# EasyEDA Pro project ProDoc_board_2025-08-24.epro

# Schematic board

## Sheets
1 board_1
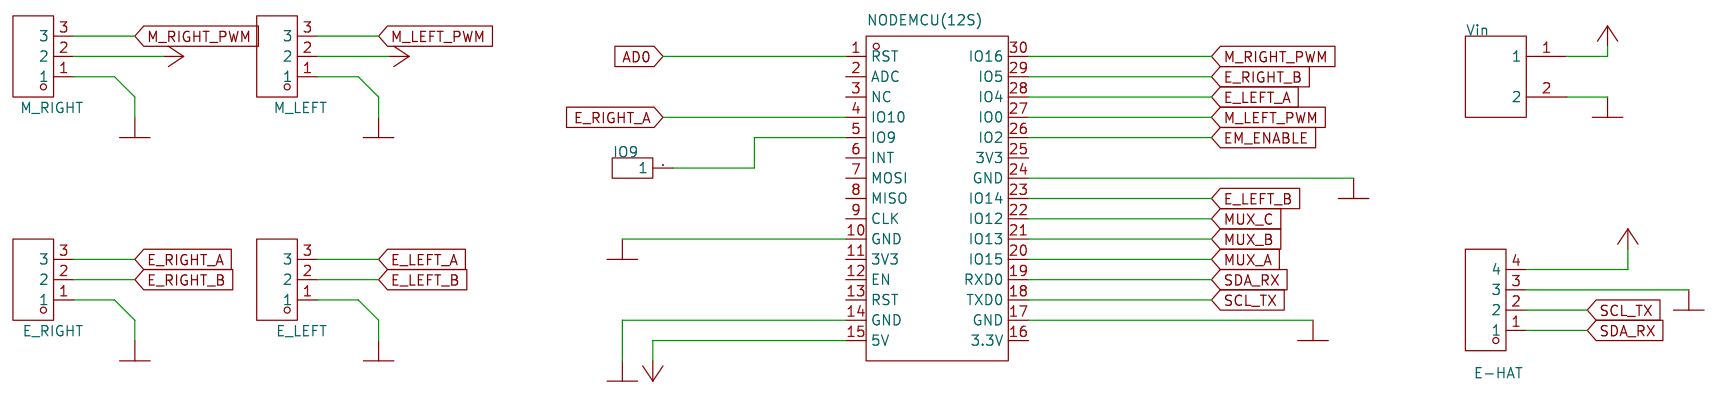
[diagram p0: board_1]
2 board_2
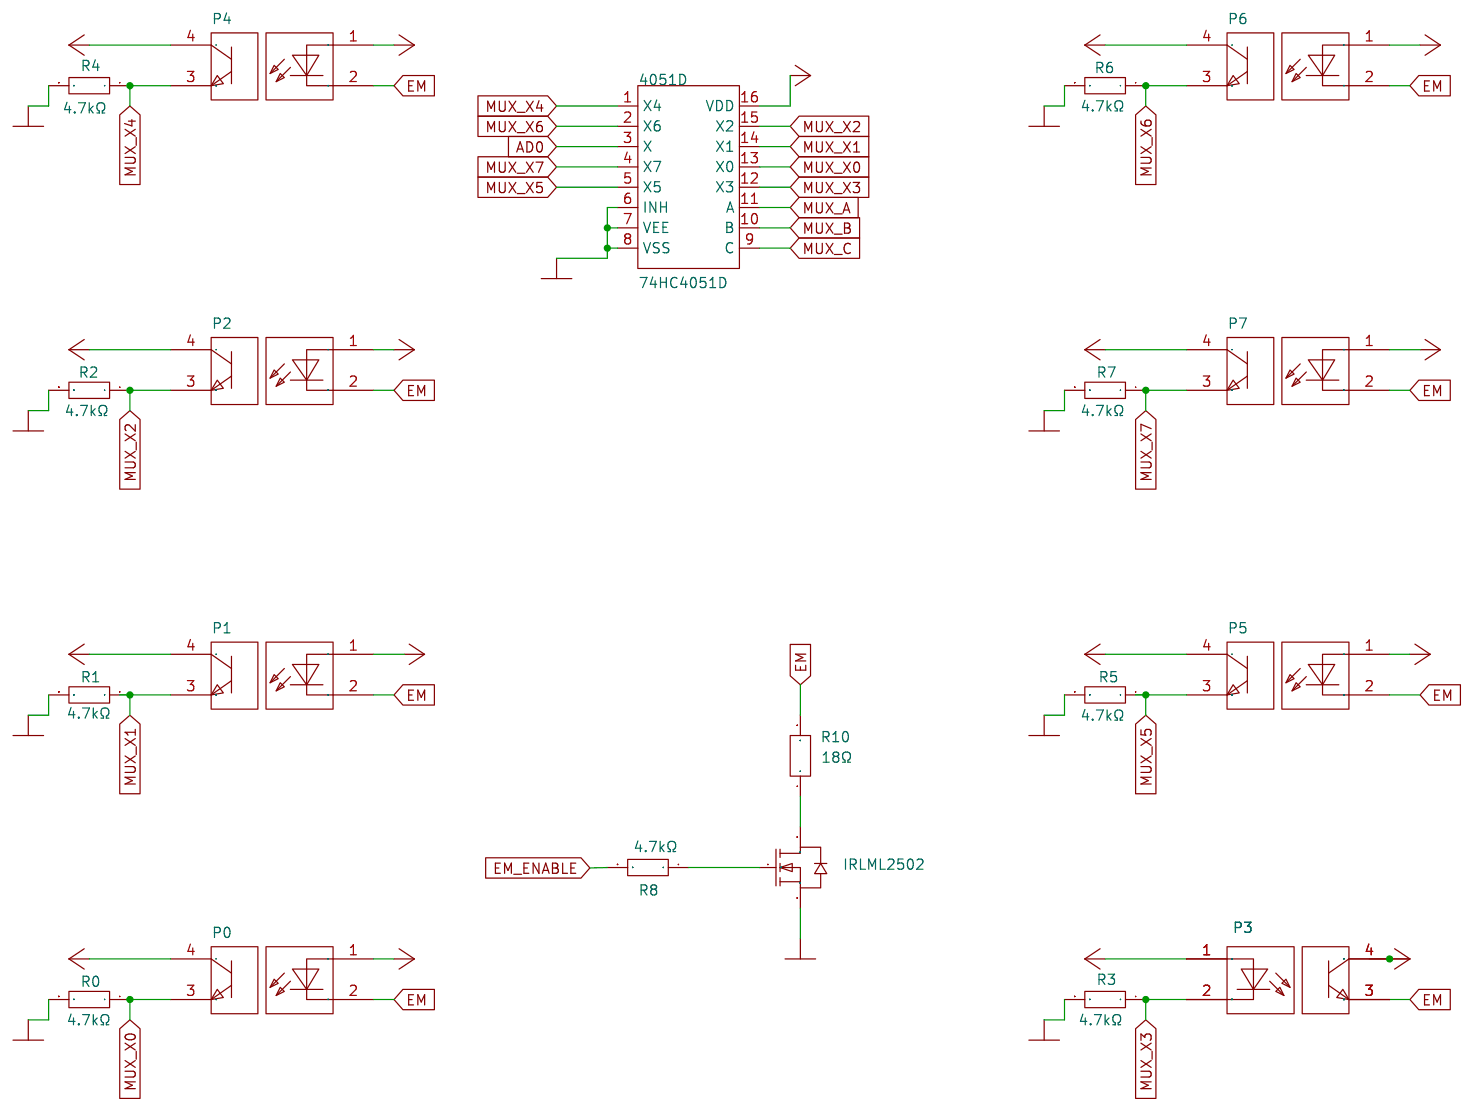
[diagram p1: board_2]
3 board_3
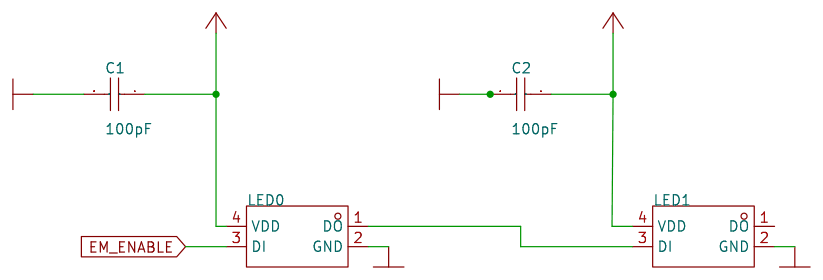
[diagram p2: board_3]

## Parts
sheet board_1
E-HAT  2.54-1*4P母  [HDR-TH_4P-P2.54-V-F]
E_LEFT  ZX-XH2.54-3PZZ  [CONN-TH_3P-P2.54_2501S-3P]
E_RIGHT  ZX-XH2.54-3PZZ  [CONN-TH_3P-P2.54_2501S-3P]
ESP-12E  NODEMCU(12S)  [COMM-TH_L43.7-W25.4-P2.54_NODEMCU]
IO9  Header-Male-2.54_1x1  [HDR-1X1/2.54]
M_LEFT  ZX-XH2.54-3PZZ  [CONN-TH_3P-P2.54_2501S-3P]
M_RIGHT  ZX-XH2.54-3PZZ  [CONN-TH_3P-P2.54_2501S-3P]
Vin  B2B-PH-K-S(LF)(SN)  [CONN-TH_B2B-PH-K-S]
sheet board_2
4051D  74HC4051D  [SOIC-16_L9.9-W3.9-P1.27-LS6.0-BL]
IRLML2502  IRLML2502TRPBF  [SOT-23_L2.9-W1.3-P1.90-LS2.4-BR]
P0  TCRT5000  [OPTO-TH_TCRT5000]
P1  TCRT5000  [OPTO-TH_TCRT5000]
P2  TCRT5000  [OPTO-TH_TCRT5000]
P3  TCRT5000  [OPTO-TH_TCRT5000]
P4  TCRT5000  [OPTO-TH_TCRT5000]
P5  TCRT5000  [OPTO-TH_TCRT5000]
P6  TCRT5000  [OPTO-TH_TCRT5000]
P7  TCRT5000  [OPTO-TH_TCRT5000]
R0  4.7kΩ  [R0603]
R1  4.7kΩ  [R0603]
R2  4.7kΩ  [R0603]
R3  4.7kΩ  [R0603]
R4  4.7kΩ  [R0603]
R5  4.7kΩ  [R0603]
R6  4.7kΩ  [R0603]
R7  4.7kΩ  [R0603]
R8  4.7kΩ  [R0603]
R10  18Ω  [R0402]
sheet board_3
C1  100pF  [C0402]
C2  100pF  [C0402]
LED0  WS2812B-2020  [LED-SMD_4P-L2.0-W2.0-TL_WS2812B-2020]
LED1  WS2812B-2020  [LED-SMD_4P-L2.0-W2.0-TL_WS2812B-2020]

## Library data of the parts
E-HAT = 2.54-1*4P母: Holes Structure:1x4P Pitch:2.54mm Row Spacing:- Circular Hole / Square Hole:Square Holes Mounting Type:Straight Number of Rows:Plugin Number of Holes:4P Current Rating (Max):3A Voltage Rating (Max):- Holes Direction:Top Insulation Height:- Contact Materia; LCSC Part Name: 间距:2.54mm 1x4P 直插; Supplier Part: C2718488; Manufacturer: BOOMELE(博穆精密); Supplier Footprint: 插件,P=2.54mm; JLCPCB Part Class: Extended Part; Datasheet: https://atta.szlcsc.com/upload/public/pdf/source/20210301/C2718488_F4427B881E42CAA8DDB0B1C12B3A522C.pdf; Supplier: LCSC; Holes Structure: 1x4P; Pitch: 2.54mm; Circular Hole / Square Hole: Square Holes; Mounting Type: Straight; Number of Rows: Plugin; Number of Holes: 4P; Current Rating (Max): 3A; Holes Direction: Top; Contact Material: bronze; Operating Temperature Range: -40℃~+105℃
E_LEFT E_RIGHT M_LEFT M_RIGHT = ZX-XH2.54-3PZZ: Pins Structure:1x3P Pitch:2.5mm Mounting Type:Direct Insert Reference Series:XH Number of Pins:3P Number of Rows:1 Number of PINs Per Row:3 Row Spacing:- Rated Current:3A Contact Material:Brass Contact Plating:Tin Operating Temperature:-25℃~+85℃ Operating; LCSC Part Name: 1x3P 间距:2.5mm 直插 系列:XH; Supplier Part: C7429633; Manufacturer: Megastar(兆星); Supplier Footprint: 插件,P=2.5mm; JLCPCB Part Class: Extended Part; Datasheet: https://atta.szlcsc.com/upload/public/pdf/source/20230619/AE17037A2CFDBE8D9CBA775D61AD0A84.pdf; Supplier: LCSC; Pins Structure: 1x3P; Pitch: 2.5mm; Mounting Type: Direct Insert; Reference Series: XH; Number of Pins: 3P; Number of Rows: 1; Number of PINs Per Row: 3; Rated Current: 3A; Contact Material: Brass; Contact Plating: Tin; Operating Temperature: -25℃~+85℃; Rated Voltage (Max): 250V; Plastic Material: PA66; Flame Retardant Rating: UL94V-0; Color: White; Z-Height of the Board: 7mm; X-Length of Bottom Edge on Board (Spacing Line): 10mm; Y-Width of Bottom Edge on Board: 5.9mm
ESP-12E = NODEMCU(12S): CPU:- ROM Size:- Number of I/O: USB:- WIFI Protocols:- Bluetooth:- Ethernet:- Audio & Video Interface:- Multimedia Support:- Card Type:- Power Supply Type:- Power Supply:- POE Support:- Resolution:- Temperature Range:-; LCSC Part Name: wifi测试板 NODEMCU(12S); Supplier Part: C2764073; Manufacturer: Ai-Thinker(安信可); JLCPCB Part Class: Extended Part; Datasheet: https://atta.szlcsc.com/upload/public/pdf/source/20210401/C2764073_24755F314752A2828420B4B3FC3498D8.pdf; Supplier: LCSC
IO9 = Header-Male-2.54_1x1: Supplier Part: C81276; Supplier: LCSC; Manufacturer: ReliaPro; spicePre: P
Vin = B2B-PH-K-S(LF)(SN): Pins Structure:1x2P Pitch:2mm Mounting Type:Direct Insert Reference Series:PH Number of Pins:2P Number of Rows:1 Number of PINs Per Row:2 Row Spacing:- Current Rating:2A Contact Material:Brass Contact Plating:Tin Operating Temperature:-25℃~+85℃ Operating; LCSC Part Name: 1x2P 间距:2mm 直插 系列:PH; Supplier Part: C131337; Manufacturer: JST; Supplier Footprint: 插件,P=2mm; JLCPCB Part Class: Extended Part; Datasheet: https://atta.szlcsc.com/upload/public/pdf/source/20171026/C131342_15089839687311058815.pdf; Supplier: LCSC; Pins Structure: 1x2P; Pitch: 2mm; Mounting Type: Direct Insert; Reference Series: PH; Number of Pins: 2P; Number of Rows: 1; Number of PINs Per Row: 2; Current Rating: 2A; Contact Material: Brass; Contact Plating: Tin; Operating Temperature: -25℃~+85℃; Voltage Rating: 100V; Plastic Material: PA66; Flame Retardant Rating: UL94V-0; Supplementary Features: K-leg punch; Color: White; Z-Height of the Board: 6mm; X-Length of Bottom Edge on Board (Spacing Line): 5.9mm; Y-Width of Bottom Edge on Board: 4.5mm
4051D = 74HC4051D: Switch Circuit:- Number of Channels:1 Supply Voltage:2V~6V Supply Voltage:2V~6V Turn-on time:34ns On-State Resistance (Max):130Ω; Supplier Part: C2673644; Manufacturer: TOSHIBA(东芝); Supplier Footprint: SOIC-16; JLCPCB Part Class: Extended Part; Datasheet: https://atta.szlcsc.com/upload/public/pdf/source/20211008/C2673644_73EA3E8FAA5905ED58292DB2FEFACB5C.pdf; Supplier: LCSC; Number of Channels: 1; Supply Voltage: 2V~6V; Turn-on time: 34ns; On-State Resistance (Max): 130Ω
IRLML2502 = IRLML2502TRPBF_C5123960: Drain to Source Voltage:20V Current - Continuous Drain(Id):- RDS(on):35mΩ@4.5V,6A Pd - Power Dissipation:1.25W Gate Threshold Voltage (Vgs(th)@Id):1V Gate Charge(Qg):7.7nC@4.5V Input Capacitance(Ciss@Vds):574pF@10V Reverse Transfer Capacitance (Crss@Vds):; LCSC Part Name: 耐压:20V 电流:6A; Supplier Part: C5123960; Manufacturer: TECH PUBLIC(台舟); Supplier Footprint: SOT-23; JLCPCB Part Class: Extended Part; Datasheet: https://atta.szlcsc.com/upload/public/pdf/source/20221011/B82AF47BD8A04DF3592B94FC71962113.pdf; Supplier: LCSC; Drain to Source Voltage: 20V; RDS(on): 35mΩ@4.5V,6A; Pd - Power Dissipation: 1.25W; Gate Threshold Voltage (Vgs(th)@Id): 1V; Gate Charge(Qg): 7.7nC@4.5V; Input Capacitance(Ciss@Vds): 574pF@10V; Operating Temperature: -55℃~+150℃
P0-P7 = TCRT5000: Sensing Distance:15mm Collector Current (Max):100mA; Supplier Part: C2984661; Manufacturer: VISHAY(威世); Supplier Footprint: DIP-4; JLCPCB Part Class: Extended Part; Datasheet: https://atta.szlcsc.com/upload/public/pdf/source/20220524/56309200CFD992CFE90087BA59F1182D.pdf; Supplier: LCSC; Sensing Distance: 15mm; Collector Current (Max): 100mA
R0-R8 = RC0603FR-074K7L: Type:Thick Film Resistors Resistance: Tolerance:±1% Tolerance:±1% Power(Watts): Overload Voltage (Max): Temperature Coefficient:±100ppm/℃ Temperature Coefficient:±100ppm/℃ Operating Temperature Range:-55℃~+155℃ Operating Temperature Range:-55℃~+155℃; LCSC Part Name: 厚膜电阻 4.7kΩ ±1% 100mW; Supplier Part: C99782; Manufacturer: YAGEO(国巨); Supplier Footprint: 0603; JLCPCB Part Class: Extended Part; Datasheet: https://atta.szlcsc.com/upload/public/pdf/source/20180224/C181757_15194369480721363983.pdf; Supplier: LCSC; Type: Thick Film Resistors; Tolerance: ±1%; Temperature Coefficient: ±100ppm/℃; Operating Temperature Range: -55℃~+155℃
R10 = FRC0402F18R0TS: Type:Thick Film Resistors Resistance: Tolerance:±1% Tolerance:±1% Power(Watts): Overload Voltage (Max): Temperature Coefficient:±100ppm/℃ Temperature Coefficient:±100ppm/℃ Operating Temperature Range:-55℃~+155℃ Operating Temperature Range:-55℃~+155℃; LCSC Part Name: 18Ω ±1% 62.5mW 厚膜电阻; Supplier Part: C2929991; Manufacturer: FOJAN(富捷); Supplier Footprint: 0402; JLCPCB Part Class: Extended Part; Datasheet: https://atta.szlcsc.com/upload/public/pdf/source/20211221/925EC7D7225764EE0046F22065062C87.pdf; Supplier: LCSC; Type: Thick Film Resistors; Tolerance: ±1%; Temperature Coefficient: ±100ppm/℃; Operating Temperature Range: -55℃~+155℃
C1 C2 = GRM1555C1H101JA01D: Capacitance: Tolerance:±5% Tolerance:±5% Voltage Rated: Temperature Coefficient:; LCSC Part Name: 100pF ±5% 50V; Supplier Part: C77177; Manufacturer: muRata(村田); Supplier Footprint: 0402; JLCPCB Part Class: Extended Part; Datasheet: https://atta.szlcsc.com/upload/public/pdf/source/20161108/1478586482814.pdf; Supplier: LCSC; Tolerance: ±5%; Check: false
LED0 LED1 = WS2812B-2020: Wavelength:515.6nm；622.5nm；470.4nm Luminous Intensity:- Fixed-Frequency Pwm Mode:- Data Transmission Rate:- Supply Voltage:- Supply Voltage:- Quiescent Dissipation:- Lens Color:-; LCSC Part Name: RGB三色; Supplier Part: C965555; Manufacturer: worldsemi; Supplier Footprint: SMD,2x2mm; JLCPCB Part Class: Extended Part; Datasheet: https://atta.szlcsc.com/upload/public/pdf/source/20241202/DEE3FC25B8AD87F3BB1718ACD77EDECD.pdf; Supplier: LCSC; Wavelength: 515.6nm；622.5nm；470.4nm; Check: false

## Nets
GND: 4051D.6(INH) 4051D.7(VEE) 4051D.8(VSS) C1.2 C2.2 E-HAT.3 E_LEFT.1 E_RIGHT.1 ESP-12E.10(GND) ESP-12E.14(GND) ESP-12E.17(GND) ESP-12E.24(GND) IRLML2502.2(S) LED0.2(GND) LED1.2(GND) M_LEFT.1 M_RIGHT.1 R0.2 R1.2 R2.2 R3.2 R4.2 R5.2 R6.2 R7.2 Vin.2
VCC: 4051D.16(VDD) C1.1 C2.1 E-HAT.4 ESP-12E.15(5V) LED0.4(VDD) LED1.4(VDD) M_LEFT.2 M_RIGHT.2 P0.1 P0.4 P1.1 P1.4 P2.1 P2.4 P3.1 P3.4 P4.1 P4.4 P5.1 P5.4 P6.1 P6.4 P7.1 P7.4 Vin.1
AD0: 4051D.3(X) ESP-12E.1(RST)
E_LEFT_A: E_LEFT.3 ESP-12E.28(IO4)
E_LEFT_B: E_LEFT.2 ESP-12E.23(IO14)
E_RIGHT_A: E_RIGHT.3 ESP-12E.4(IO10)
E_RIGHT_B: E_RIGHT.2 ESP-12E.29(IO5)
EM: P0.2 P1.2 P2.2 P3.3 P4.2 P5.2 P6.2 P7.2 R10.2
EM_ENABLE: ESP-12E.26(IO2) LED0.3(DI)
M_LEFT_PWM: ESP-12E.27(IO0) M_LEFT.3
M_RIGHT_PWM: ESP-12E.30(IO16) M_RIGHT.3
MUX_A: 4051D.11(A) ESP-12E.20(IO15)
MUX_B: 4051D.10(B) ESP-12E.21(IO13)
MUX_C: 4051D.9(C) ESP-12E.22(IO12)
MUX_X0: 4051D.13(X0) P0.3 R0.1
MUX_X1: 4051D.14(X1) P1.3 R1.1
MUX_X2: 4051D.15(X2) P2.3 R2.1
MUX_X3: 4051D.12(X3) P3.2 R3.1
MUX_X4: 4051D.1(X4) P4.3 R4.1
MUX_X5: 4051D.5(X5) P5.3 R5.1
MUX_X6: 4051D.2(X6) P6.3 R6.1
MUX_X7: 4051D.4(X7) P7.3 R7.1
SCL_TX: E-HAT.2 ESP-12E.18(TXD0)
SDA_RX: E-HAT.1 ESP-12E.19(RXD0)
$1N3482: ESP-12E.5(IO9) IO9.1
$2N5544: IRLML2502.3(D) R10.1
Net-(LED0-1): LED0.1(DO) LED1.3(DI)

Not connected (* = marked no-connect by the designer): ESP-12E 2(ADC) 3(NC) 6(INT) 7(MOSI) 8(MISO) 9(CLK) 11(3V3) 12(EN) 13(RST) 16(3.3V) 25(3V3); IRLML2502 1(G); LED1 1(DO); R8 1 2

# Board board
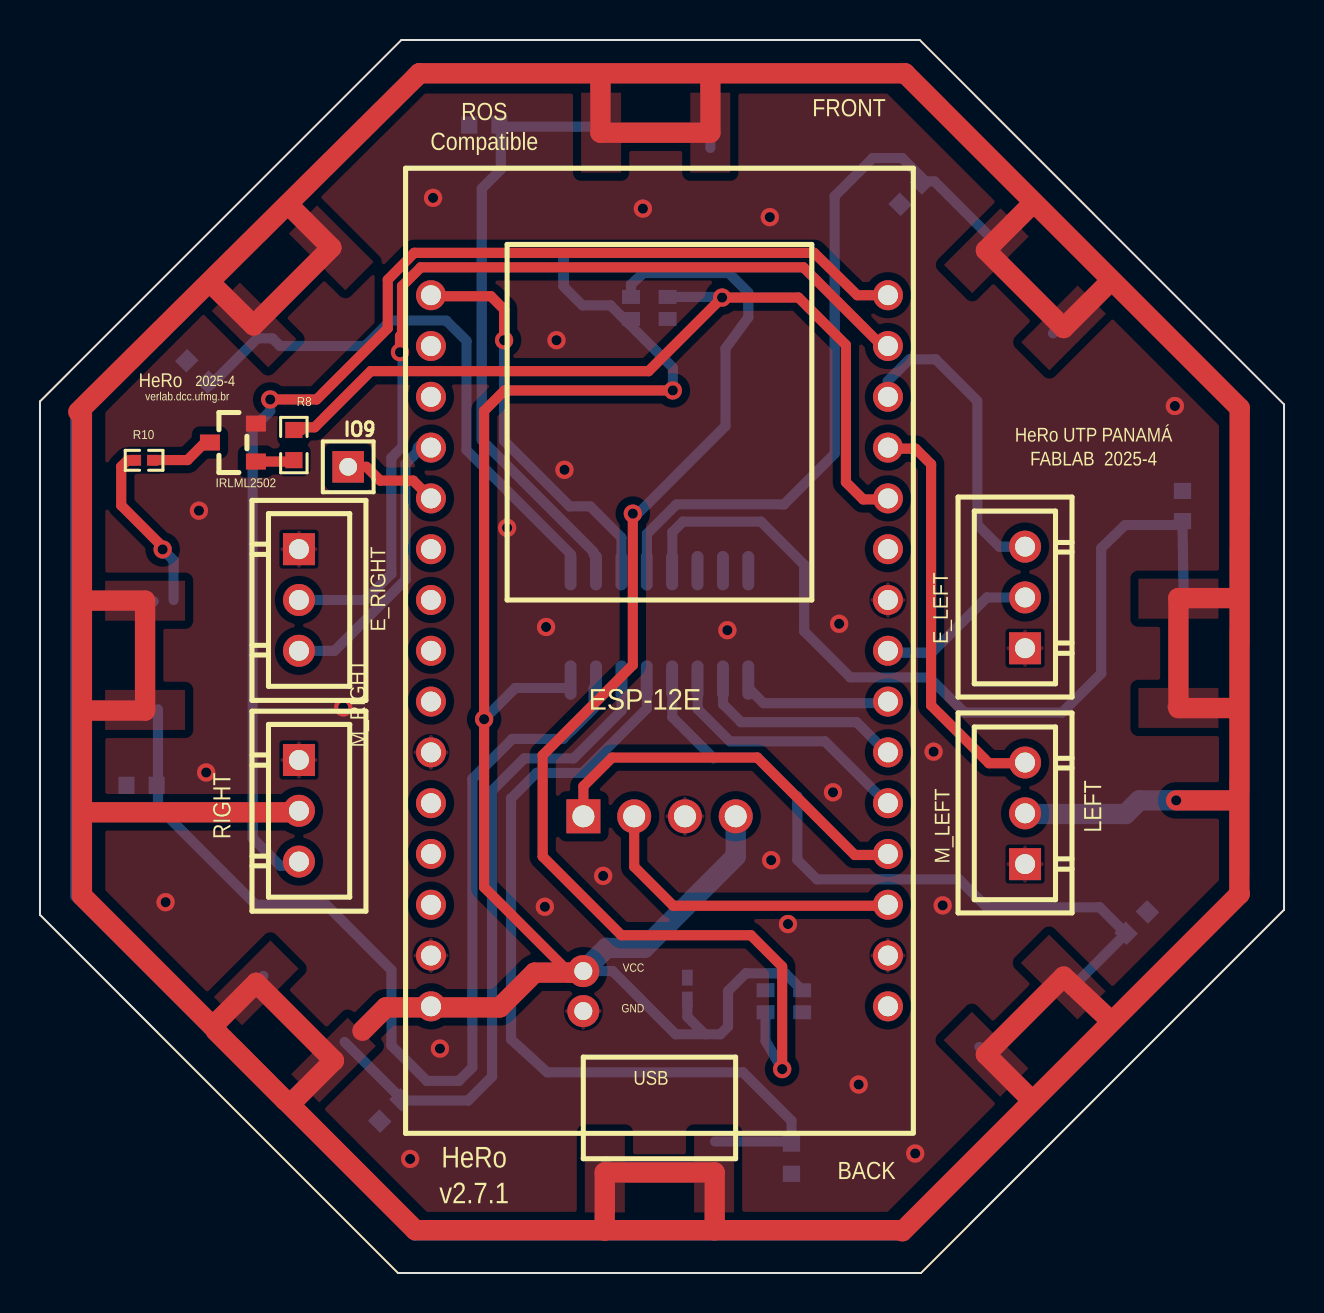
[diagram p3: board, top side]
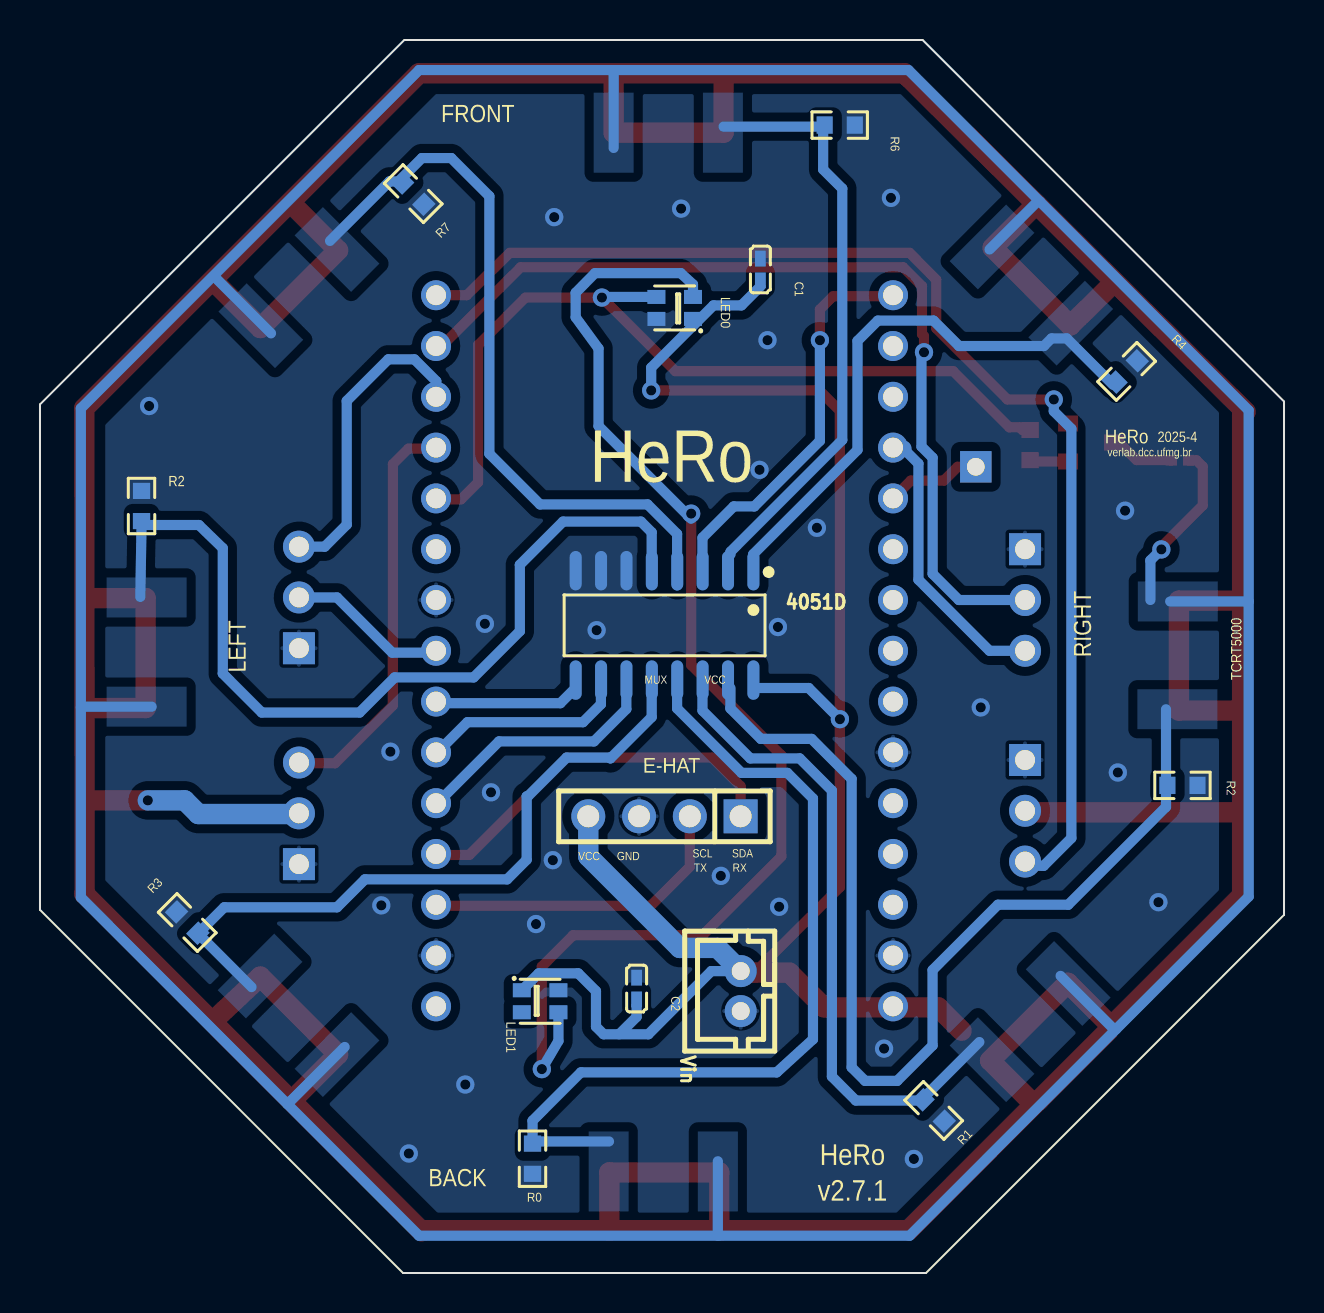
[diagram p4: board, bottom side, seen from below]

Outline 62.23 x 61.66 mm; copper layers: Top Layer, Bottom Layer. Coordinates in mm from the lower left corner of the outline.
Outline path: 0,43.58 0,17.91 17.91,0 44.07,0 62.23,18.16 62.23,43.43 44.01,61.66 18.08,61.66 0,43.58
Stack: Top Layer 0.035mm / Dielectric1 1.51mm FR4 er 4.5 / Bottom Layer 0.035mm

## Design rules (mm)
spacing safeClearance (default): track to track 0.203, other pairs 0.203 to 1.016
spacing gnd: track to track 0.203, other pairs 0.203 to 1.016
track width trackWidth (default): min 0.508, default 0.508, max 2.54
track width gnd: min 0.508, default 0.508, max 2.54
differential pair differentialPair (default): width min 0.127, default 0.254, max 2.54; gap min 0.152, default 0.152
via viaSize (default): diameter min 0.508, default 0.508, max 2.6; hole min 0.508, default 0.508, max 2
via gnd: diameter min 0.508, default 0.508, max 2.6; hole min 0.508, default 0.508, max 2
net GND uses CopperRegion1
pour ie1 uses CopperRegion
pour ie2 uses CopperRegion1

## Placement (name value [footprint] x y rotation side)
4051D  74HC4051D  [SOIC-16_L9.9-W3.9-P1.27-LS6.0-BL]  30.99 32.39 0 bottom
C1  100pF  [C0402]  26.19 50.18 90 bottom
C2  100pF  [C0402]  32.39 14.22 90 bottom
E-HAT  2.54-1*4P母  [HDR-TH_4P-P2.54-V-F]  30.99 22.84 0 bottom
E_LEFT  ZX-XH2.54-3PZZ  [CONN-TH_3P-P2.54_2501S-3P]  49.28 33.78 90 top
E_RIGHT  ZX-XH2.54-3PZZ  [CONN-TH_3P-P2.54_2501S-3P]  12.95 33.66 270 top
ESP-12E  NODEMCU(12S)  [COMM-TH_L43.7-W25.4-P2.54_NODEMCU]  30.99 31.11 0 top
IO9  Header-Male-2.54_1x1  [HDR-1X1/2.54]  15.42 40.31 0 top
IRLML2502  IRLML2502TRPBF  [SOT-23_L2.9-W1.3-P1.90-LS2.4-BR]  9.65 41.53 0 top
LED0  WS2812B-2020  [LED-SMD_4P-L2.0-W2.0-TL_WS2812B-2020]  30.48 48.26 0 bottom
LED1  WS2812B-2020  [LED-SMD_4P-L2.0-W2.0-TL_WS2812B-2020]  37.21 13.59 180 bottom
M_LEFT  ZX-XH2.54-3PZZ  [CONN-TH_3P-P2.54_2501S-3P]  49.28 22.99 90 top
M_RIGHT  ZX-XH2.54-3PZZ  [CONN-TH_3P-P2.54_2501S-3P]  12.95 23.11 270 top
R0  4.7kΩ  [R0603]  37.59 5.72 270 bottom
R1  4.7kΩ  [R0603]  17.53 8.13 225 bottom
R2  4.7kΩ  [R0603]  5.08 24.38 180 bottom
R3  4.7kΩ  [R0603]  54.86 17.53 45 bottom
R4  4.7kΩ  [R0603]  7.87 45.09 135 bottom
R5  4.7kΩ  [R0603]  57.15 38.35 90 bottom
R6  4.7kΩ  [R0603]  22.23 57.4 180 bottom
R7  4.7kΩ  [R0603]  43.56 53.97 225 bottom
R8  4.7kΩ  [R0603]  12.7 41.4 90 top
R10  18Ω  [R0402]  5.21 40.64 180 top
Vin  B2B-PH-K-S(LF)(SN)  [CONN-TH_B2B-PH-K-S]  27.18 14.1 90 bottom

## Footprints (pads in the part's own frame, mm; a bottom-side part is the same pattern mirrored in y, then rotated)
C0402
  rect 0.79x0.54 smd: 1(-0.545,0) 2(0.545,0)
COMM-TH_L43.7-W25.4-P2.54_NODEMCU
  round 1.5 hole 1: 1(-11.43,17.78) 2(-11.43,15.24) 3(-11.43,12.7) 4(-11.43,10.16) 5(-11.43,7.62) 6(-11.43,5.08) 7(-11.43,2.54) 8(-11.43,0) 9(-11.43,-2.54) 10(-11.43,-5.08) 11(-11.43,-7.62) 12(-11.43,-10.16) 13(-11.43,-12.7) 14(-11.43,-15.24) 15(-11.43,-17.78) 16(11.43,-17.78) 17(11.43,-15.24) 18(11.43,-12.7) 19(11.43,-10.16) 20(11.43,-7.62) 21(11.43,-5.08) 22(11.43,-2.54) 23(11.43,0) 24(11.43,2.54) 25(11.43,5.08) 26(11.43,7.62) 27(11.43,10.16) 28(11.43,12.7) 29(11.43,15.24) 30(11.43,17.78)
CONN-TH_3P-P2.54_2501S-3P
  rect 1.6x1.6 hole 1: 1(-2.54,0)
  round 1.6 hole 1: 2(0,0) 3(2.54,0)
CONN-TH_B2B-PH-K-S
  round 1.6 hole 0.9: 1(1,0) 2(-1,0)
HDR-1X1/2.54
  rect 1.575x1.575 hole 0.889: 1(0,0)
HDR-TH_4P-P2.54-V-F
  rect 1.7x1.7 hole 1.1: 1(-3.81,0)
  round 1.7 hole 1.1: 2(-1.27,0) 3(1.27,0) 4(3.81,0)
LED-SMD_4P-L2.0-W2.0-TL_WS2812B-2020
  rect 0.9x0.7 smd: 1(-0.915,0.55) 2(-0.915,-0.55) 3(0.915,-0.55) 4(0.915,0.55)
R0402
  rect 0.566x0.54 smd: 1(-0.433,0) 2(0.433,0)
R0603
  rect 0.806x0.864 smd: 1(-0.753,0) 2(0.753,0)
SOIC-16_L9.9-W3.9-P1.27-LS6.0-BL
  oval 0.602x1.971 smd: 1(-4.445,-2.736) 2(-3.175,-2.736) 3(-1.905,-2.736) 4(-0.635,-2.736) 5(0.635,-2.736) 6(1.905,-2.736) 7(3.175,-2.736) 8(4.445,-2.736) 9(4.445,2.736) 10(3.175,2.736) 11(1.905,2.736) 12(0.635,2.736) 13(-0.635,2.736) 14(-1.905,2.736) 15(-3.175,2.736) 16(-4.445,2.736)
SOT-23_L2.9-W1.3-P1.90-LS2.4-BR
  rect 1x0.8 smd: 1(1.15,-0.95) 2(1.15,0.95) 3(-1.15,0)

## Nets
As in the schematic, except:
GND: 4051D.6 4051D.7 4051D.8 C1.2 C2.2 E-HAT.3 E_LEFT.1 E_RIGHT.1 ESP-12E.10 ESP-12E.14 ESP-12E.17 ESP-12E.24 IRLML2502.2 LED0.4 LED1.4 M_LEFT.1 M_RIGHT.1 R0.2 R1.2 R2.2 R3.2 R4.2 R5.2 R6.2 R7.2 Vin.2
VCC: 4051D.16 C1.1 C2.1 E-HAT.4 ESP-12E.15 LED0.1 LED1.1 M_LEFT.2 M_RIGHT.2 Vin.1
EM_ENABLE: ESP-12E.26 LED0.3 R8.2
$2N5552: IRLML2502.1 R8.1
$3N657: LED0.2 LED1.3

Pads without a net: ESP-12E 2 3 6 7 8 9 11 12 13 16 25; LED1 2

## Via types
v1: diameter 0.914, hole 0.508, Top Layer to Bottom Layer, 35 vias

## Routing (per net, layer and track width the routed paths; a pad name or vN(x,y) marks a point on that pad's centre or on a via; arc(x,y) is an arc through that point)
GND:
  vias: v1(6.28,18.54) v1(7.95,38.12) v1(8.31,25.03) v1(15.17,28.28) v1(18.52,5.7) v1(19.66,53.76) v1(20.01,11.22) v1(23.37,37.26) v1(25.32,32.3) v1(25.26,18.31) v1(25.84,46.65) v1(26.24,40.16) v1(28.17,19.86) v1(30.16,53.22) v1(34.39,32.14) v1(36.51,52.8) v1(36.58,20.64) v1(37.42,17.45) v1(39.67,24.04) v1(39.98,32.46) v1(40.95,9.42) v1(43.78,5.98) v1(44.7,26.07) v1(45.16,18.38) v1(56.77,43.36)
VCC: length 398.9
  Top Layer w0.508: v1(31.66,44.13) 23.24,44.13 22.22,43.11 v1(22.22,27.69) 22.22,19.29 26.49,15.02
  Top Layer w1.016: 1.92,43.07 18.98,59.99 ; 18.98,59.99 18.76,59.77 ; 18.98,59.99 43.27,59.99 60.02,43.24 60,18.94 ; 2.34,33.62 5.26,33.62 5.26,28.12 2.36,28.12 ; 8.64,49.4 10.69,47.38 14.57,51.27 12.44,53.4 ; 8.75,12.45 10.81,14.51 14.7,10.62 12.65,8.57 ; 16.13,12.11 17.3,13.28 23.01,13.28 24.74,15.02 27.18,15.02 ; 28.04,59.92 28.04,57.02 33.53,57.02 33.53,59.94 ; 28.25,2.11 28.25,5.03 33.75,5.03 33.75,2.13 ; 49.37,53.19 47.32,51.14 51.21,47.25 53.27,49.32 ; 49.53,8.73 47.32,10.93 51.21,14.82 53.47,12.7 ; 59.85,33.75 56.95,33.75 56.95,28.25 59.86,28.25 ; 1.97,43.02 2.1,42.89 2.1,18.88 8.69,12.28 ; 60.02,18.96 60,18.94 ; 60,18.94 43.14,2.08 ; 12.4,8.52 18.78,2.14 43.14,2.14 ; 12.97,23.04 2.2,23.04 ; 12.3,8.63 12.27,8.63 8.79,12.11 ; v1(56.84,23.63) 59.77,23.63
  Bottom Layer w0.508: Vin.1 28.65,15.1 31.8,11.94 34.04,11.94 34.42,12.32 34.42,14.1 35.31,14.99 37.28,14.99 LED1.1 ; 32.39,13.37 32.39,12.81 33.25,11.94 ; v1(31.66,44.13) 31.66,45.27 28.54,48.39 27.14,48.39 26.19,49.33 ; 26.55,29.25 23.78,29.25 v1(22.22,27.69)
  Bottom Layer w1.016: Vin.1 28.34,16.26 30.23,16.26 34.8,20.83 E-HAT.4 ; 49.25,22.95 54.31,22.95 54.99,23.63 v1(56.84,23.63)
AD0: length 19.8
  Top Layer w0.508: 19.55,48.84 22.56,48.84 23.22,48.18 v1(23.22,46.64)
  Bottom Layer w0.508: 29.09,35.4 29.09,36.77 27.53,38.33 26.5,38.33 23.22,41.61 v1(23.22,46.64)
E_LEFT_A: length 15.7
  Bottom Layer w0.508: E_LEFT.3 47.98,36.32 46.89,37.42 46.89,43.61 44.81,45.69 43.5,45.69 42.41,44.6 42.41,43.76
E_LEFT_B: length 8
  Bottom Layer w0.508: 42.41,31.06 42.45,31.02 44.61,31.02 47.37,33.78 E_LEFT.2
E_RIGHT_A: length 14.2
  Bottom Layer w0.508: 19.04,41.22 18.29,40.47 18.29,34.67 14.73,31.11 E_RIGHT.3
  Bottom Layer w0.813: 19.55,41.22 19.04,41.22
E_RIGHT_B: length 46.2
  Top Layer w0.508: 42.41,46.3 42.18,46.3 38.19,50.29 19.05,50.29 18.11,49.35 18.11,46.95 18.01,46.85 v1(18.01,46.04)
  Bottom Layer w0.508: v1(18.01,46.04) 18.14,45.92 18.14,41.33 17.58,40.77 17.58,34.97 16.27,33.66 E_RIGHT.2
EM: length 232.8
  Top Layer w0.508: R10.2 4.38,40.64 4.06,40.33 4.06,38.38 6.14,36.31 v1(6.14,36.18)
  Bottom Layer w0.508: 1.77,33.58 1.77,33.58 5.69,33.58 ; v1(6.14,36.18) 6.68,35.64 6.68,33.66 ; 8.4,12.2 8.51,12.2 11.18,14.86 ; 12.21,53.58 12.33,53.58 14.73,51.18 ; 28.32,5.59 28.32,1.88 28.31,1.86 ; 33.54,60.15 33.53,60.15 33.53,56.26 ; 46.99,11.3 49.84,8.46 49.86,8.46 ; 50.67,46.99 53.45,49.77 53.45,49.81 ; 56.64,28.32 60.15,28.32 60.19,28.28 ; 43.27,60.15 18.79,60.15 1.77,43.14 1.77,18.82 18.73,1.86 43.27,1.86 60.19,18.78 60.19,43.23 43.27,60.15
EM_ENABLE: length 43.4
  Top Layer w0.508: v1(34.12,48.78) 37.94,48.78 40.32,46.4 40.32,39.54 41.18,38.68 42.41,38.68 ; R8.2 13.08,42.16 13.22,42.29 13.74,42.29 16.54,45.1 30.44,45.1 34.12,48.78
  Bottom Layer w0.508: LED0.3 34.09,48.81 v1(34.12,48.78)
M_LEFT_PWM: length 20.4
  Top Layer w0.508: 49.25,25.49 47.47,25.49 44.58,28.38 44.58,40.44 43.8,41.22 42.41,41.22
M_RIGHT_PWM: length 61.8
  Top Layer w0.508: v1(11.52,43.68) 13.84,43.68 17.4,47.24 17.4,49.67 18.73,51.02 38.73,51.02 40.88,48.89 ESP-12E.30 42.66,48.84
  Bottom Layer w0.508: M_RIGHT.3 12.74,20.36 12.02,20.36 10.64,21.75 10.64,42.22 11.52,43.1 v1(11.52,43.68)
MUX_A: length 12.5
  Bottom Layer w0.508: 42.41,23.44 39.27,26.58 34.52,26.58 32.9,28.2 32.9,29.25
MUX_B: length 10.1
  Bottom Layer w0.508: 42.41,25.98 40.85,27.54 35.07,27.54 34.17,28.44 34.17,29.25
MUX_C: length 7.3
  Bottom Layer w0.508: 42.41,28.52 42.38,28.49 36.2,28.49 35.44,29.25
MUX_X1: length 32.6
  Bottom Layer w0.508: 15.24,11.55 18.17,8.62 21.42,8.62 22.62,9.82 22.62,24.12 24.23,25.73 26.7,25.73 29.09,28.13 29.09,29.25
MUX_X4: length 28.2
  Bottom Layer w0.508: 26.55,35.4 26.55,35.94 21.34,41.16 21.34,46.61 20.32,47.62 17.53,47.62 16.26,46.36 12.01,46.36 11.63,46.74 10.87,46.74 8.55,44.41
SCL_TX: length 16
  Top Layer w0.508: E-HAT.2 29.72,20.32 31.68,18.36 42.41,18.36
SDA_RX: length 19.3
  Top Layer w0.508: E-HAT.1 27.18,24.34 28.62,25.77 35.89,25.77 40.76,20.9 42.41,20.9
$1N3482: length 4.8
  Top Layer w0.508: IO9.1 16.33,40.31 17.02,39.62 18.67,39.62 ESP-12E.5
$2N5544: length 3.3
  Top Layer w0.508: 8.55,41.53 8.26,41.53 7.38,40.65 5.65,40.65 R10.1
$2N5552: length 2
  Top Layer w0.508: 10.75,40.58 12.63,40.58 R8.1
$3N657: length 62.2
  Top Layer w0.508: v1(37.13,10.2) 37.13,15.33 35.56,16.89 29.08,16.89 25.15,20.83 25.15,25.89 29.66,30.4 v1(29.66,37.97)
  Bottom Layer w0.508: LED0.2 29.57,49.44 30.18,50 34.47,50 35.43,49.02 35.43,47.79 34.29,46.23 34.29,42.35 29.66,37.72 ; LED1.3 36.3,11.6 v1(37.13,10.2)
MUX_X0: length 42.4
  Bottom Layer w0.508: 30.36,29.35 30.36,28.23 27.14,25.01 24.84,25.01 23.56,23.73 23.56,11.69 25.38,10.03 35.17,10.03 37.59,7.61 37.59,6.58 33.77,6.58
MUX_X2: length 51.7
  Bottom Layer w0.508: 5.9,28.19 5.9,23.31 10.8,18.42 14.31,18.42 17.58,15.15 17.58,11.38 19.35,9.61 20.95,9.61 21.63,10.28 21.63,24.71 23.63,26.71 26.17,26.71 27.69,28.23 27.69,29.25
MUX_X3: length 34.3
  Bottom Layer w0.508: 31.63,29.25 31.63,27.8 33.7,25.73 33.74,25.77 35.89,25.77 37.82,23.84 37.88,23.84 37.88,20.66 38.86,19.69 45.97,19.69 47.37,18.29 53.01,18.29 54.32,16.98 54.32,16.97 51.65,14.3
MUX_X5: length 44.8
  Bottom Layer w0.508: 31.63,35.06 31.63,37.04 32.17,37.57 36.07,37.57 38.23,35.41 38.23,32.09 40.54,29.78 44.49,29.78 46.24,28.03 51.13,28.03 53.09,29.98 53.09,36.25 54.28,37.4 57.15,37.4 57.21,33.81
MUX_X6: length 29.1
  Bottom Layer w0.508: 27.69,35.94 27.69,36.07 22.1,41.66 22.1,54.23 23.05,55.18 23.05,57.32 28.03,57.32
MUX_X7: length 37
  Bottom Layer w0.508: 30.36,34.39 30.36,36.96 31.84,38.43 37.22,38.43 39.75,40.97 39.75,53.85 41.66,55.75 43.13,55.75 44.23,54.65 ; 44.17,54.59 44.75,54.59 47.72,51.61

## Copper pours and planes (outline as drawn; the poured copper is in the pictures)
GND on Top Layer: 19.3,2.89 42.45,2.89 59.13,19.57 59.13,42.45 42.45,59.13 19.15,59.13 3.12,43.1 3.12,19.08
GND on Bottom Layer: 19.32,2.87 42.41,2.87 59.11,19.57 59.11,42.47 42.48,59.11 19.11,59.11 3.11,43.1 3.11,19.08
VCC on Top Layer: 3.26,29.16 7.26,29.16 7.26,27.16 3.26,27.16
VCC on Top Layer: 32.72,7.03 34.72,7.03 34.72,3.03 32.72,3.03
VCC on Top Layer: 49.08,49.38 53.32,49.38 53.32,45.14 49.08,45.14
VCC on Top Layer: 54.95,29.26 58.95,29.26 58.95,27.26 54.95,27.26
VCC on Top Layer: 27.26,7.03 29.26,7.03 29.26,3.03 27.26,3.03
VCC on Top Layer: 12.45,53.39 16.69,53.39 16.69,49.15 12.45,49.15
VCC on Top Layer: 8.7,16.63 12.94,16.63 12.94,12.39 8.7,12.39
VCC on Top Layer: 49.06,16.92 53.31,16.92 53.31,12.68 49.06,12.68
VCC on Top Layer: 8.59,49.53 12.83,49.53 12.83,45.29 8.59,45.29
VCC on Top Layer: 3.26,34.62 7.26,34.62 7.26,32.62 3.26,32.62
VCC on Top Layer: 27.07,59.02 29.07,59.02 29.07,55.02 27.07,55.02
VCC on Top Layer: 32.53,59.02 34.53,59.02 34.53,55.02 32.53,55.02
VCC on Top Layer: 45.22,53.24 49.46,53.24 49.46,49 45.22,49
VCC on Top Layer: 12.56,12.77 16.8,12.77 16.8,8.53 12.56,8.53
VCC on Top Layer: 45.2,13.06 49.44,13.06 49.44,8.82 45.2,8.82
VCC on Top Layer: 54.95,34.72 58.95,34.72 58.95,32.72 54.95,32.72
EM on Bottom Layer: 27.32,7.08 29.32,7.08 29.32,3.08 27.32,3.08
EM on Bottom Layer: 45.25,13.04 49.49,13.04 49.49,8.8 45.25,8.8
EM on Bottom Layer: 32.53,59.02 34.53,59.02 34.53,55.02 32.53,55.02
EM on Bottom Layer: 3.31,34.58 7.31,34.58 7.31,32.58 3.31,32.58
EM on Bottom Layer: 12.48,53.43 16.73,53.43 16.73,49.19 12.48,49.19
EM on Bottom Layer: 8.67,16.6 12.92,16.6 12.92,12.36 8.67,12.36
EM on Bottom Layer: 54.9,29.32 58.9,29.32 58.9,27.32 54.9,27.32
EM on Bottom Layer: 49.06,49.49 53.3,49.49 53.3,45.25 49.06,45.25
MUX_X0 on Bottom Layer: 32.78,7.08 34.78,7.08 34.78,3.08 32.78,3.08
MUX_X1 on Bottom Layer: 12.48,12.79 16.73,12.79 16.73,8.55 12.48,8.55
MUX_X2 on Bottom Layer: 3.33,29.19 7.33,29.19 7.33,27.19 3.33,27.19
MUX_X3 on Bottom Layer: 49.1,16.97 53.34,16.97 53.34,12.73 49.1,12.73
MUX_X4 on Bottom Layer: 8.55,49.62 12.79,49.62 12.79,45.38 8.55,45.38
MUX_X5 on Bottom Layer: 54.9,34.78 58.9,34.78 58.9,32.78 54.9,32.78
MUX_X6 on Bottom Layer: 27.07,59.02 29.07,59.02 29.07,55.02 27.07,55.02
MUX_X7 on Bottom Layer: 45.25,53.3 49.49,53.3 49.49,49.06 45.25,49.06

## Text on the board
Bottom Silkscreen Layer: VCC      GND | verlab.dcc.ufmg.br | MUX             VCC | SCL       SDA / TX         RX | TCRT5000 | 2025-4 | R2 | HeRo | RIGHT | LEFT | FRONT | BACK | HeRo / v2.7.1
Top Silkscreen Layer: verlab.dcc.ufmg.br | VCC | GND | 2025-4 | USB | HeRo | HeRo UTP PANAMÁ / FABLAB  2025-4 | ROS / Compatible | FRONT | BACK | RIGHT | LEFT | HeRo / v2.7.1
